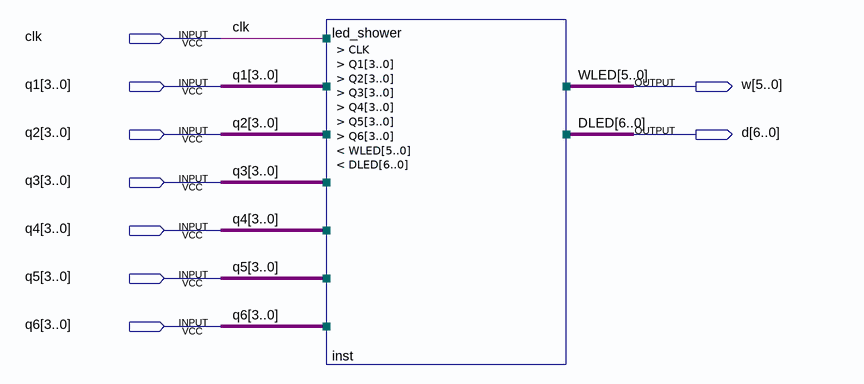
[diagram p0: schematic sheet]
// Quartus schematic time_shower_vhdl.bdf as structural Verilog: 1 symbols, 9 pins
module time_shower_vhdl (
  input  clk,
  input  [3:0] q1,
  input  [3:0] q2,
  input  [3:0] q3,
  input  [3:0] q4,
  input  [3:0] q5,
  input  [3:0] q6,
  output [5:0] w,
  output [6:0] d
);

  led_shower inst (.CLK(clk), .Q1(q1), .Q2(q2), .Q3(q3), .Q4(q4), .Q5(q5), .Q6(q6), .WLED(w), .DLED(d));

  // Other names for the same wires on the sheet: DLED[6:0] = d; WLED[5:0] = w
endmodule
